# Altium schematic sheet heater-LC-filtering.SchDoc
size A4
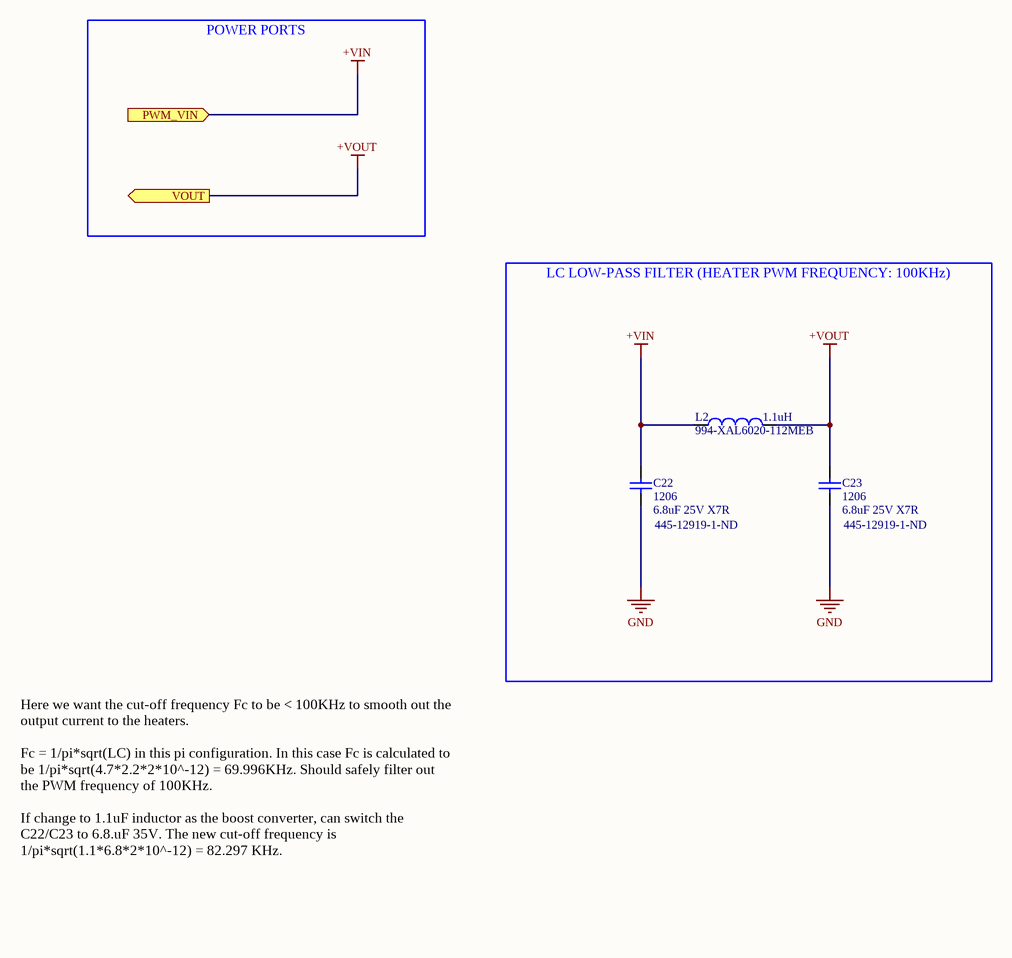
[diagram p0: heater-LC-filtering.SchDoc]

## Parts
C22  1206  value 6.8uF 25V X7R  Supplier Part Number 1: 445-12919-1-ND  [CAP1206R]
C23  1206  value 6.8uF 25V X7R  Supplier Part Number 1: 445-12919-1-ND  [CAP1206R]
L2  value 1.1uH  Supplier Part Number 1: 994-XAL6020-112MEB  [XAL6030-122]  (hidden comment: Inductor)

## Ports
PWM_VIN (in), VOUT (out)

## Nets
+VIN: C22.2 L2.1 ; port PWM_VIN
+VOUT: C23.2 L2.2 ; port VOUT
GND: C22.1 C23.1

## Notes on the sheet
- POWER PORTS
- LC LOW-PASS FILTER (HEATER PWM FREQUENCY: 100KHz)
- Here we want the cut-off frequency Fc to be < 100KHz to smooth out the output current to the heaters.
  Fc = 1/pi*sqrt(LC) in this pi configuration. In this case Fc is calculated to be 1/pi*sqrt(4.7*2.2*2*10^-12) = 69.996KHz. Should safely filter out the PWM frequency of 100KHz.
  If change to 1.1uF inductor as the boost converter, can switch the C22/C23 to 6.8.uF 35V. The new cut-off frequency is 1/pi*sqrt(1.1*6.8*2*10^-12) = 82.297 KHz.

## Library data of the parts
C22 C23 = CAP1206: 1206 capacitor; Supplier 1: Digi-Key
L2 = Inductor: Code_IEC: 1005; Published: 8-Jun-2000; LatestRevisionDate: 29-May-2009; LatestRevisionNote: IPC-7351 Footprint Added.; PackageReference: 0402-A; Publisher: Altium Limited; PackageDescription: Chip Inductor; Code_JEITA: 0402; Supplier 1: Mouser